# Altium schematic sheet AUDIO_HEADPHONES_MIC.SchDoc: HEADPHONES OUT, MIC IN
size A4; Author: Silvio Navaretti; CompanyName: Arduino SRL; DrawnBy: Silvio Navaretti; Engineer: Silvio Navaretti; Organization: Arduino SRL; DocumentNumber: ASX00083; SheetNumber: 8; SheetTotal: 11; RevAuthor: Silvio Navaretti
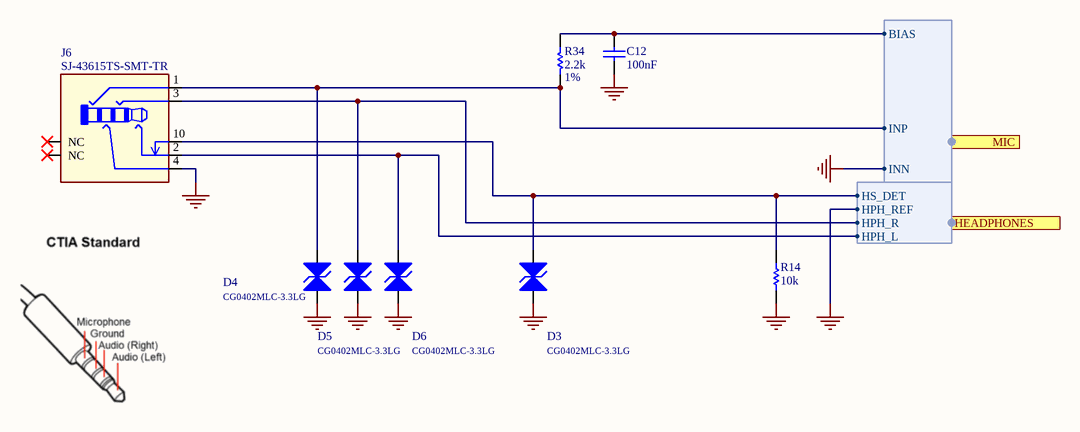
[diagram p0: AUDIO_HEADPHONES_MIC.SchDoc]

## Parts
C12  value 100nF  [CAP-0402]  (hidden comment: GRM155R61H104KE19D)
D3  CG0402MLC-3.3LG  [0402]
D4  CG0402MLC-3.3LG  [0402]
D5  CG0402MLC-3.3LG  [0402]
D6  CG0402MLC-3.3LG  [0402]
J6  SJ-43615TS-SMT-TR  [SJ-43615TS-SMT-TR]
R14  value 10k  [RES-0402]  (hidden comment: CRCW040210K0FKED)
R34  value 2.2k  Tolerance: 1%  [RES-0402]  (hidden comment: AF0402FR-072K2L)

## Ports
HEADPHONES (harness HEADPHONES), MIC (harness MIC)

## Harnesses
MIC: INP, INN, BIAS
HEADPHONES: HPH_L, HPH_R, HPH_REF, HS_DET

## Nets
GND: C12.1 D3.A D4.A D5.A D6.A J6.4 R14.1 ; port MIC.INN, port HEADPHONES.HPH_REF
NetC12_2: C12.2 R34.1 ; port MIC.BIAS
NetD3_C: D3.C J6.10 R14.2 ; port HEADPHONES.HS_DET
NetD4_C: D4.C J6.1 R34.2 ; port MIC.INP
NetD5_C: D5.C J6.3 ; port HEADPHONES.HPH_R
NetD6_C: D6.C J6.2 ; port HEADPHONES.HPH_L

Not connected (* = marked no-connect by the designer): J6 11(NC)* 12(NC)*

## Notes on the sheet
- Title:
- ID:
- Date:
- Time:
- Version:
- Sheet
- of
- RevAuthor:
- Reference Designs ARE PROVIDED "AS IS" AND "WITH ALL FAULTS. Arduino SA DISCLAIMS ALL OTHER WARRANTIES, EXPRESS OR IMPLIED, REGARDING PRODUCTS, INCLUDING BUT NOT LIMITED TO, ANY IMPLIED WARRANTIES OF MERCHANTABILITY OR FITNESS FOR A PARTICULAR PURPOSE.
  Arduino SA may make changes to specifications and product descriptions at any time, without notice. The Customer must not rely on the absence or characteristics of any features or instructions marked "reserved" or "undefined". Arduino SA reserves these for future definition and shall have no responsibility whatsoever for conflicts or incompatibilities arising from future changes to them. The product information on the Web Site or Materials is subject to change without notice.
  Do not finalize a design with this info. ARDUINO and other Arduino brands and logos and Trademarks of Arduino SA. All Arduino SA Trademarks cannot be used without owner's formal permission.
- File:
- Author:

## Library data of the parts
C12 = C0015-A.14: CAP CHIP 0402 100nF 10% 50V X5R; Manufacturer: Murata; Code Arduino: A5141; Part Number: GRM155R61H104KE19D; Dielectric: X5R; Tolerance: 10%; Technology: Ceramic; Voltage: 50V; Case Code (Imperial): 0402
D3-D6 = D0073-A.3: DIODE TVS SMD 0402 3.3V ESD PROTECTION; Manufacturer: Bourns; Code Arduino: D0073; Direction: Bidirectional; Part Number: CG0402MLC-3.3LG; Device Type: ESD protection; Datasheet: https://www.mouser.it/datasheet/2/54/MLC-777442.pdf
J6 = J0533-A.9: CONN Audio Jack 3.5mm, 4 conductor, tip switch, SMD mid mount; Manufacturer: Same Sky; Code Arduino: J0533; Part Number: SJ-43615TS-SMT-TR
R14 = R0003-A.24: RES CHIP 0402 10k 1% 1/16W; Manufacturer: Vishay; Code Arduino: 0136; Power: 62.5mW; Temperature coefficient: 100ppm; Case Code (Imperial): 0402; Part Number: CRCW040210K0FKED; Technology: Thick film; Tolerance: 1%
R34 = R0286-A.3: RES CHIP 0402 2k2 1% 1/16W; Manufacturer: Yageo; Temperature coefficient: 100ppm; Power: 62.5mW; Code Arduino: R0286; Technology: Thick film; Manufacturer 2: Hottech; Part Number 2: RI0402L2201FT; Part Number: AF0402FR-072K2L; Case Code (Imperial): 0402